# Altium schematic sheet BLOCK_SCHEME.SchDoc
size A4; SheetNumber: 1; SheetTotal: 3
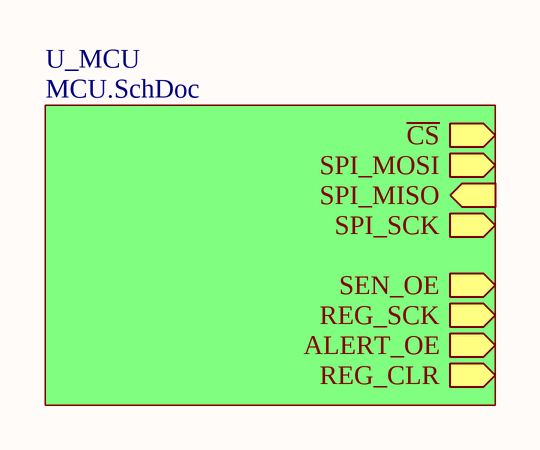
[diagram p0: BLOCK_SCHEME.SchDoc]

## Sub-sheets
U_MCU = MCU.SchDoc: SPI_MISO (in), SPI_SCK (out), SPI_MOSI (out), ~{CS} (out), SEN_OE (out), REG_SCK (out), ALERT_OE (out), REG_CLR (out)